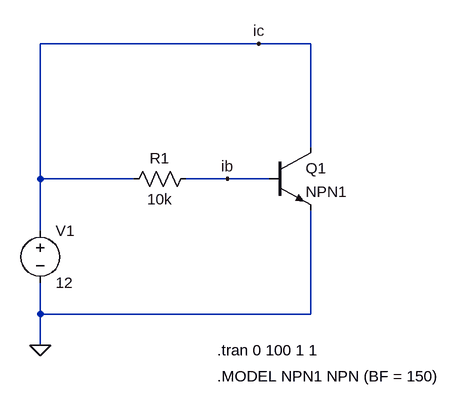
[diagram p0: schematic Draft8.asc]
Draft8.asc, the LTspice schematic file:
Version 4
SHEET 1 880 680
WIRE 368 32 32 32
WIRE 448 32 368 32
WIRE 448 192 448 32
WIRE 32 240 32 32
WIRE 176 240 32 240
WIRE 320 240 256 240
WIRE 384 240 320 240
WIRE 32 320 32 240
WIRE 32 448 32 400
WIRE 448 448 448 288
WIRE 448 448 32 448
WIRE 32 496 32 448
FLAG 32 496 0
FLAG 368 32 ic
FLAG 320 240 ib
DATAFLAG 736 128 "$"
SYMBOL npn 384 192 R0
SYMATTR InstName Q1
SYMATTR Value NPN1
SYMBOL res 272 224 R90
WINDOW 0 0 56 VBottom 2
WINDOW 3 32 56 VTop 2
SYMATTR InstName R1
SYMATTR Value 10k
SYMBOL voltage 32 304 R0
SYMATTR InstName V1
SYMATTR Value 12
TEXT 304 544 Left 2 !.MODEL NPN1 NPN (BF = 150)
TEXT 304 504 Left 2 !.tran 0 100 1 1

The netlist it stands for:
* Draft8.asc
Q1 ic ib 0 0 NPN1
R1 ib ic 10k
V1 ic 0 12
.model NPN NPN
.model PNP PNP
.lib standard.bjt
.MODEL NPN1 NPN (BF = 150)
.tran 0 100 1 1
.backanno
.end